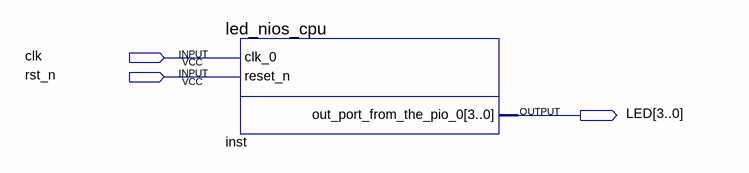
[diagram p0: schematic sheet]
// Quartus schematic led_nios.bdf as structural Verilog: 1 symbols, 3 pins
module led_nios (
  input  clk,
  input  rst_n,
  output [3:0] LED
);

  led_nios_cpu inst (.clk_0(clk), .reset_n(rst_n), .out_port_from_the_pio_0(LED));
endmodule
